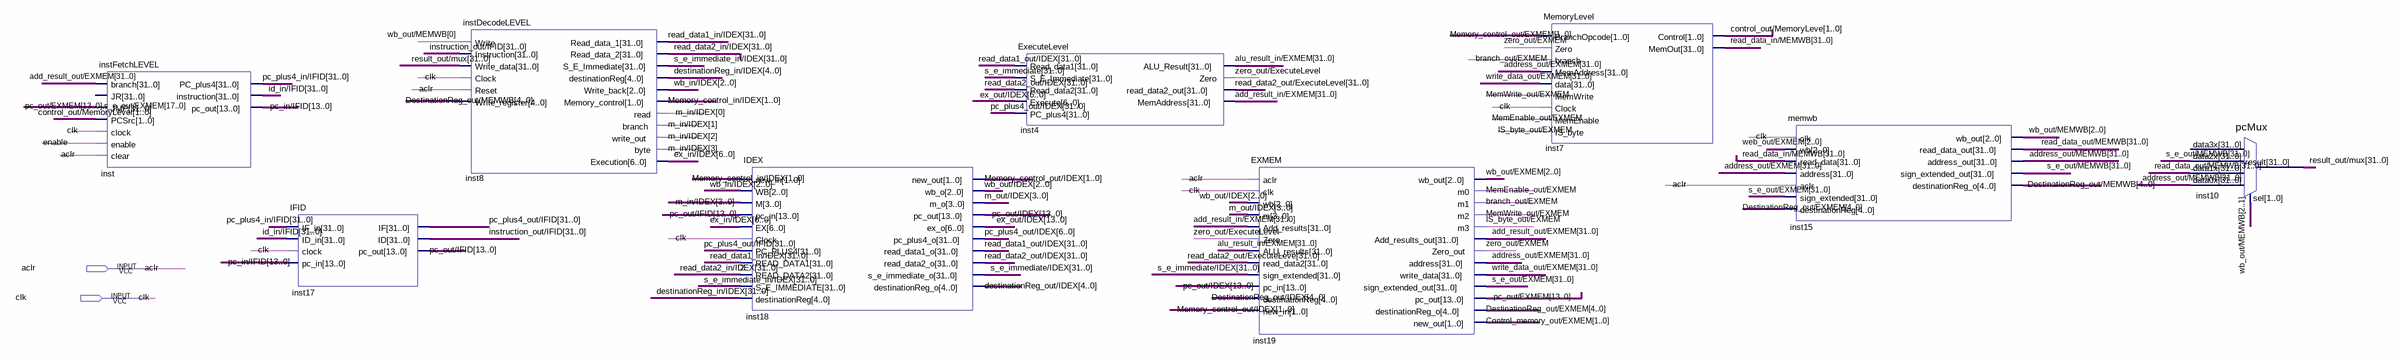
[diagram p0: schematic sheet]
// Quartus schematic sarbazi-main.bdf as structural Verilog: 9 symbols, 2 pins
module \sarbazi-main  (
  input  aclr,
  input  clk
);

  wire \branch_out/EXMEM , enable, \IS_byte_out/EXMEM , \MemEnable_out/EXMEM , \MemWrite_out/EXMEM ,
       \zero_out/ExecuteLevel , \zero_out/EXMEM ;
  wire [1:0] \Control_memory_out/EXMEM , \control_out/MemoryLeve , \control_out/MemoryLevel ,
       \Memory_control_in/IDEX , \Memory_control_out/EXMEM , \Memory_control_out/IDEX ;
  wire [2:0] \wb_in/IDEX , \wb_out/EXMEM , \wb_out/IDEX , \wb_out/MEMWB , \web_out/EXMEM ;
  wire [3:0] \m_in/IDEX , \m_out/IDEX ;
  wire [4:0] \DestinationReg_out/EXMEM , \destinationReg_out/IDEX , \DestinationReg_out/MEMWB ;
  wire [6:0] \ex_in/IDEX ;
  wire [13:0] \ex_out/IDEX , \pc_in/IFID , \pc_out/EXMEM , \pc_out/IDEX , \pc_out/IFID ;
  wire [31:0] \add_result_in/EXMEM , \add_result_out/EXMEM , \address_out/EXMEM , \address_out/MEMWB ,
       \alu_result_in/EXMEM , \destinationReg_in/IDEX , \id_in/IFID , \instruction_out/IFID ,
       \pc_plus4_in/IFID , \pc_plus4_out/IDEX , \pc_plus4_out/IFID , \read_data1_in/IDEX ,
       \read_data1_out/IDEX , \read_data2_in/IDEX , \read_data2_out/ExecuteLeve ,
       \read_data2_out/ExecuteLevel , \read_data2_out/IDEX , \read_data_in/MEMWB , \read_data_out/MEMWB ,
       \result_out/mux , s_e_immediate, \s_e_immediate/IDEX , \s_e_immediate_in/IDEX , \s_e_out/EXMEM ,
       \s_e_out/MEMWB , \write_data_out/EXMEM ;

  instFetchLEVEL inst (
    .branch(\add_result_out/EXMEM ), .JMP({\pc_out/EXMEM , \s_e_out/EXMEM [17:0]}),
    .PCSrc(\control_out/MemoryLevel ), .clock(clk), .enable(enable), .clear(aclr),
    .PC_plus4(\pc_plus4_in/IFID ), .instruction(\id_in/IFID ), .pc_out(\pc_in/IFID ));  // open: JR
  IFID inst17 (
    .IF_in(\pc_plus4_in/IFID ), .ID_in(\id_in/IFID ), .clock(clk), .pc_in(\pc_in/IFID ),
    .IF(\pc_plus4_out/IFID ), .ID(\instruction_out/IFID ), .pc_out(\pc_out/IFID ));
  instDecodeLEVEL inst8 (
    .Write(\wb_out/MEMWB [0]), .Instruction(\instruction_out/IFID ), .Write_data(\result_out/mux ),
    .Clock(clk), .Reset(aclr), .Write_register(\DestinationReg_out/MEMWB ),
    .Read_data_1(\read_data1_in/IDEX ), .Read_data_2(\read_data2_in/IDEX ),
    .S_E_Immediate(\s_e_immediate_in/IDEX ), .destinationReg(\destinationReg_in/IDEX [4:0]),
    .Write_back(\wb_in/IDEX ), .Memory_control(\Memory_control_in/IDEX ), .read(\m_in/IDEX [0]),
    .branch(\m_in/IDEX [1]), .write_out(\m_in/IDEX [2]), .\byte (\m_in/IDEX [3]), .Execution(\ex_in/IDEX ));
  IDEX inst18 (
    .new_in(\Memory_control_in/IDEX ), .WB(\wb_in/IDEX ), .M(\m_in/IDEX ), .pc_in(\pc_out/IFID ),
    .EX(\ex_in/IDEX ), .Clock(clk), .PC_PLUS4(\pc_plus4_out/IFID ), .READ_DATA1(\read_data1_in/IDEX ),
    .READ_DATA2(\read_data2_in/IDEX ), .S_E_IMMEDIATE(\s_e_immediate_in/IDEX ),
    .destinationReg(\destinationReg_in/IDEX ), .new_out(\Memory_control_out/IDEX ), .wb_o(\wb_out/IDEX ),
    .m_o(\m_out/IDEX ), .pc_out(\pc_out/IDEX ), .ex_o(\ex_out/IDEX ), .pc_plus4_o(\pc_plus4_out/IDEX [6:0]),
    .read_data1_o(\read_data1_out/IDEX ), .read_data2_o(\read_data2_out/IDEX ),
    .s_e_immediate_o(\s_e_immediate/IDEX ), .destinationReg_o(\destinationReg_out/IDEX ));
  ExecuteLevel inst4 (
    .Read_data1(\read_data1_out/IDEX ), .S_E_Immediate(s_e_immediate), .Read_data2(\read_data2_out/IDEX ),
    .Execute(\ex_out/IDEX [6:0]), .PC_plus4(\pc_plus4_out/IDEX ), .ALU_Result(\alu_result_in/EXMEM ),
    .Zero(\zero_out/ExecuteLevel ), .read_data2_out(\read_data2_out/ExecuteLevel ),
    .MemAddress(\add_result_in/EXMEM ));
  EXMEM inst19 (
    .aclr(aclr), .clk(clk), .wb(\wb_out/IDEX ), .m(\m_out/IDEX ), .Add_results(\add_result_in/EXMEM ),
    .Zero(\zero_out/ExecuteLevel ), .ALU_results(\alu_result_in/EXMEM ),
    .read_data2(\read_data2_out/ExecuteLeve ), .sign_extended(\s_e_immediate/IDEX ), .pc_in(\pc_out/IDEX ),
    .destinationReg(\destinationReg_out/IDEX ), .new_in(\Memory_control_out/IDEX ), .wb_out(\wb_out/EXMEM ),
    .m0(\MemEnable_out/EXMEM ), .m1(\branch_out/EXMEM ), .m2(\MemWrite_out/EXMEM ), .m3(\IS_byte_out/EXMEM ),
    .Add_results_out(\add_result_out/EXMEM ), .Zero_out(\zero_out/EXMEM ), .address(\address_out/EXMEM ),
    .write_data(\write_data_out/EXMEM ), .sign_extended_out(\s_e_out/EXMEM ), .pc_out(\pc_out/EXMEM ),
    .destinationReg_o(\DestinationReg_out/EXMEM ), .new_out(\Control_memory_out/EXMEM ));
  MemoryLevel inst7 (
    .BranchOpcode(\Memory_control_out/EXMEM ), .Zero(\zero_out/EXMEM ), .branch(\branch_out/EXMEM ),
    .MemAddress(\address_out/EXMEM ), .data(\write_data_out/EXMEM ), .MemWrite(\MemWrite_out/EXMEM ),
    .Clock(clk), .MemEnable(\MemEnable_out/EXMEM ), .IS_byte(\IS_byte_out/EXMEM ),
    .Control(\control_out/MemoryLeve ), .MemOut(\read_data_in/MEMWB ));
  memwb inst15 (
    .clk(clk), .wb(\web_out/EXMEM ), .read_data(\read_data_in/MEMWB ), .address(\address_out/EXMEM ),
    .aclr(aclr), .sign_extended(\s_e_out/EXMEM ), .destinationReg(\DestinationReg_out/EXMEM ),
    .wb_out(\wb_out/MEMWB ), .read_data_out(\read_data_out/MEMWB ), .address_out(\address_out/MEMWB ),
    .sign_extended_out(\s_e_out/MEMWB ), .destinationReg_o(\DestinationReg_out/MEMWB ));
  pcMux inst10 (
    .data2x(\s_e_out/MEMWB ), .data1x(\read_data_out/MEMWB ), .data0x(\address_out/MEMWB ),
    .sel(\wb_out/MEMWB [2:1]), .result(\result_out/mux ));  // open: data3x

  // Notes on the sheet:
  //   2
endmodule
